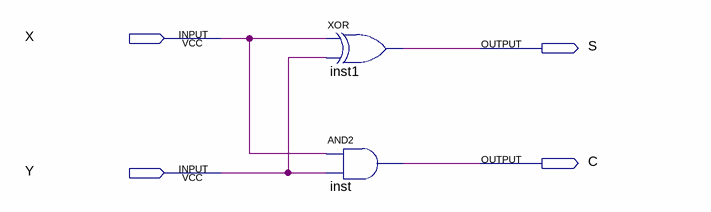
[diagram p0: schematic sheet]
// Quartus schematic half_adder.bdf as structural Verilog: 2 symbols, 4 pins
module half_adder (
  input  X,
  input  Y,
  output S,
  output C
);

  xor inst1 (S, X, Y);
  and inst (C, X, Y);
endmodule
